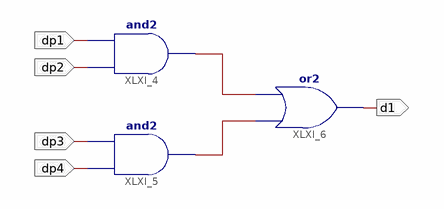
[diagram p0: schematic sheet 1]
// Xilinx ISE schematic boolean2.sch (spartan6) as structural Verilog: 3 symbols, 5 ports
module boolean2 (
  input  dp1,
  input  dp2,
  input  dp3,
  input  dp4,
  output d1
);

  wire XLXN_9, XLXN_10;

  and XLXI_4 (XLXN_9, dp2, dp1);
  and XLXI_5 (XLXN_10, dp4, dp3);
  or XLXI_6 (d1, XLXN_10, XLXN_9);
endmodule
